# Altium schematic sheet Memory_EEPROM.SchDoc
size B; Author: E. Sims; Organization: Let's Build Rockets Inc.; SheetNumber: 2; SheetTotal: 2
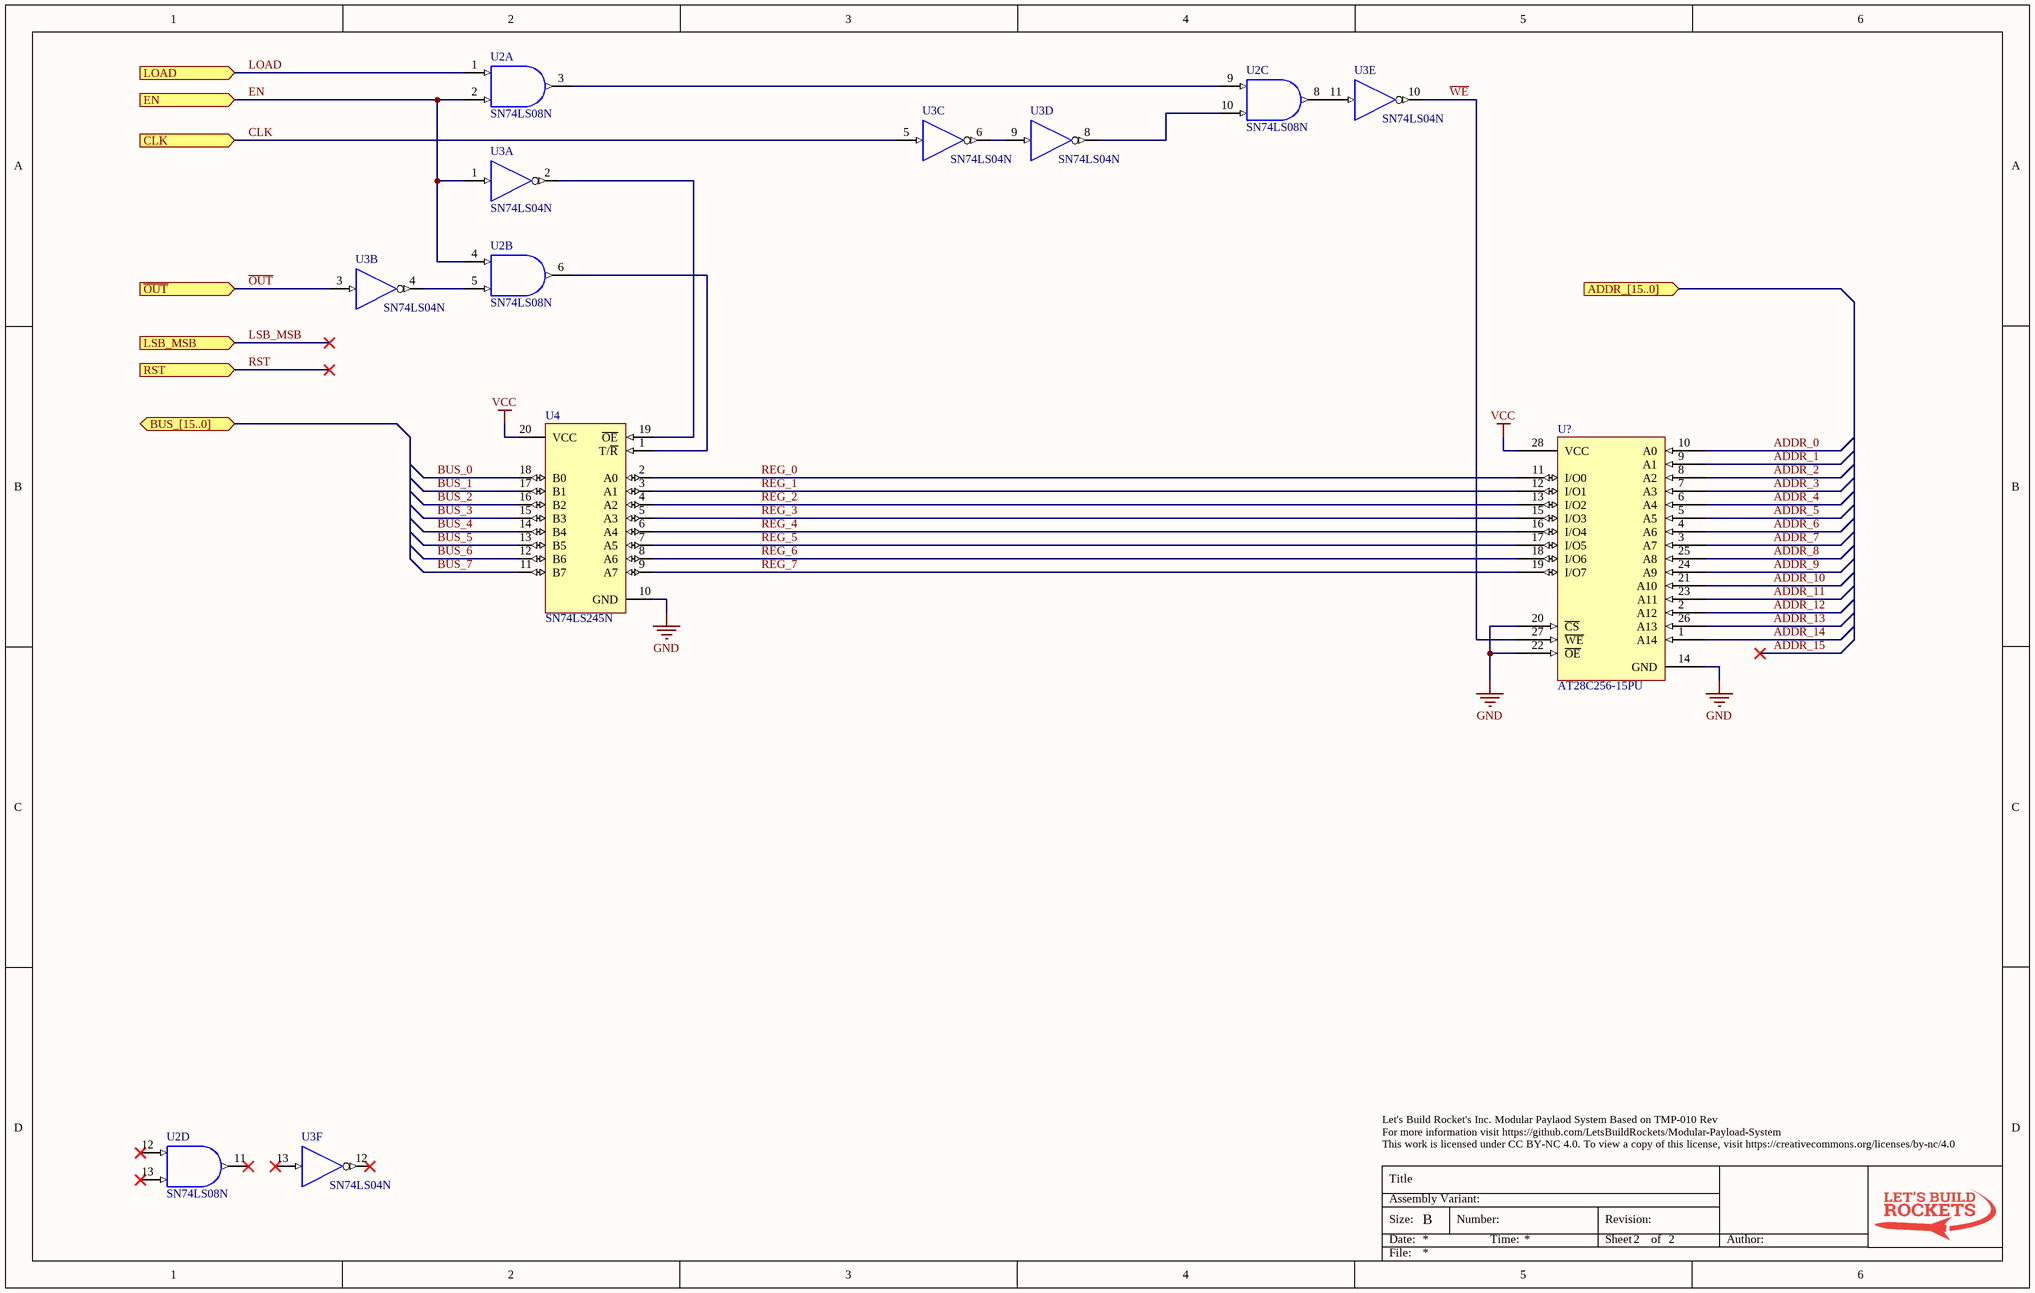
[diagram p0: Memory_EEPROM.SchDoc]

## Parts
U2  SN74LS08N  [N014]  (parts A,B,C,D of 4)
U3  SN74LS04N  [N014]  (parts A,B,C,D,E,F of 6)
U4  SN74LS245N  [N020]
U?  AT28C256-15PU  [J028]

## Ports
ADDR_[15..0] (in), BUS_[15..0] (bidir), CLK (in), EN (in), LOAD (in), LSB_MSB (in), RST (in), ~{OUT} (in)

## Nets
GND: U2.7(GND) U3.7(GND) U4.10(GND) U?.14(GND) U?.20(~{CS}) U?.22(~{OE})
VCC: U2.14(VCC) U3.14(VCC) U4.20(VCC) U?.28(VCC)
ADDR_0: U?.10(A0)
ADDR_1: U?.9(A1)
ADDR_2: U?.8(A2)
ADDR_3: U?.7(A3)
ADDR_4: U?.6(A4)
ADDR_5: U?.5(A5)
ADDR_6: U?.4(A6)
ADDR_7: U?.3(A7)
ADDR_8: U?.25(A8)
ADDR_9: U?.24(A9)
ADDR_10: U?.21(A10)
ADDR_11: U?.23(A11)
ADDR_12: U?.2(A12)
ADDR_13: U?.26(A13)
ADDR_14: U?.1(A14)
BUS_0: U4.18(B0)
BUS_1: U4.17(B1)
BUS_2: U4.16(B2)
BUS_3: U4.15(B3)
BUS_4: U4.14(B4)
BUS_5: U4.13(B5)
BUS_6: U4.12(B6)
BUS_7: U4.11(B7)
CLK: U3.5(A) ; port CLK
EN: U2.2(B) U2.4(A) U3.1(A) ; port EN
LOAD: U2.1(A) ; port LOAD
LSB_MSB: port LSB_MSB
~{OUT}: U3.3(A) ; port ~{OUT}
REG_0: U4.2(A0) U?.11(I/O0)
REG_1: U4.3(A1) U?.12(I/O1)
REG_2: U4.4(A2) U?.13(I/O2)
REG_3: U4.5(A3) U?.15(I/O3)
REG_4: U4.6(A4) U?.16(I/O4)
REG_5: U4.7(A5) U?.17(I/O5)
REG_6: U4.8(A6) U?.18(I/O6)
REG_7: U4.9(A7) U?.19(I/O7)
RST: port RST
~{WE}: U3.10(Y) U?.27(~{WE})
NetU2_3: U2.3(Y) U2.9(A)
NetU2_5: U2.5(B) U3.4(Y)
NetU2_6: U2.6(Y) U4.1(T/~{R})
NetU2_8: U2.8(Y) U3.11(A)
NetU2_10: U2.10(B) U3.8(Y)
NetU3_2: U3.2(Y) U4.19(~{OE})
NetU3_6: U3.6(Y) U3.9(A)

Not connected (* = marked no-connect by the designer): U2 11(Y)* 12(A)* 13(B)*; U3 12(Y)* 13(A)*

## Notes on the sheet
- Let's Build Rocket's Inc. Modular Paylaod System Based on TMP-010 Rev
  For more information visit https://github.com/LetsBuildRockets/Modular-Payload-System
  This work is licensed under CC BY-NC 4.0. To view a copy of this license, visit https://creativecommons.org/licenses/by-nc/4.0
- Title
- Size:
- Date:
- Assembly Variant:
- B
- Number:
- Time:
- Revision:
- Sheet
- of
- Author:
- File:

## Library data of the parts
U2 = SN74LS08N: Quadruple 2-Input Positive-AND Gate; Published: 8-Jun-2000; LatestRevisionDate: 04-Mar-2005; LatestRevisionNote: Stylized 3D Model Added.; DatasheetVersion: Mar-1988; PackageVersion: Oct-1995; PackageReference: N014; Publisher: Altium Limited; PackageDescription: DIP; 14 Leads; Row Spacing 7.62 mm; Pitch 2.54 mm; ComponentLink1Description: Manufacturer Link; ComponentLink1URL: http://www.ti.com/; ComponentLink2Description: Datasheet; ComponentLink2URL: http://www-s.ti.com/sc/ds/SN74LS08.pdf
U3 = SN74LS04N: Hex Inverter; Published: 8-Jun-2000; LatestRevisionDate: 04-Mar-2005; LatestRevisionNote: Stylized 3D Model Added.; DatasheetVersion: Mar-1988; PackageVersion: Oct-1995; PackageReference: N014; Publisher: Altium Limited; PackageDescription: DIP; 14 Leads; Row Spacing 7.62 mm; Pitch 2.54 mm; ComponentLink1Description: Manufacturer Link; ComponentLink1URL: http://www.ti.com/; ComponentLink2Description: Datasheet; ComponentLink2URL: http://www-s.ti.com/sc/ds/sn74ls04.pdf
U4 = SN74LS245N: Octal Bus Transceiver with 3-State Outputs; Published: 8-Jun-2000; LatestRevisionDate: 04-Mar-2005; LatestRevisionNote: Stylized 3D Model Added.; DatasheetVersion: Mar-1988; PackageVersion: Oct-1995; PackageReference: N020; Publisher: Altium Limited; PackageDescription: DIP; 20 Leads; Row Spacing 7.62 mm; Pitch 2.54 mm; ComponentLink1Description: Manufacturer Link; ComponentLink1URL: http://www.ti.com/; ComponentLink2Description: Datasheet; ComponentLink2URL: http://www-s.ti.com/sc/ds/sn74ls245.pdf